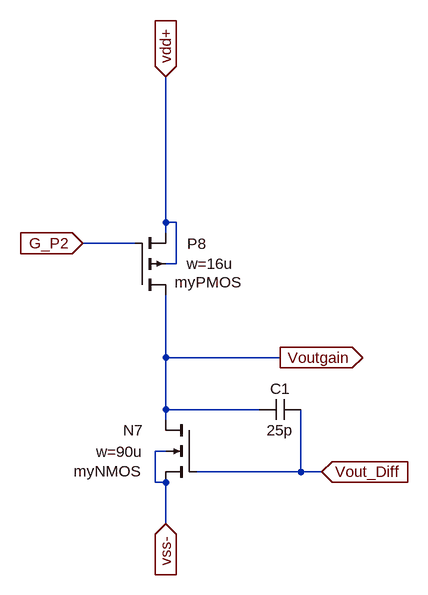
[diagram p0: schematic Gain_Amplifier.asc]
Gain_Amplifier.asc, the LTspice schematic file:
Version 4
SHEET 1 880 680
WIRE 160 -144 160 -368
WIRE 176 -144 160 -144
WIRE 160 -128 160 -144
WIRE 112 -112 32 -112
WIRE 176 -80 176 -144
WIRE 176 -80 160 -80
WIRE 160 64 160 -32
WIRE 336 64 160 64
WIRE 160 144 160 64
WIRE 304 144 160 144
WIRE 160 160 160 144
WIRE 160 208 144 208
WIRE 368 240 368 144
WIRE 368 240 208 240
WIRE 400 240 368 240
WIRE 144 256 144 208
WIRE 160 256 144 256
WIRE 160 320 160 256
FLAG 400 240 Vout_Diff
IOPIN 400 240 In
FLAG 160 -368 vdd+
IOPIN 160 -368 In
FLAG 336 64 Voutgain
IOPIN 336 64 Out
FLAG 160 320 vss-
IOPIN 160 320 In
FLAG 32 -112 G_P2
IOPIN 32 -112 In
SYMBOL pmos4 112 -32 M180
WINDOW 3 62 20 Left 2
WINDOW 0 81 79 Left 2
WINDOW 123 80 48 Left 2
SYMATTR Value myPMOS
SYMATTR InstName P8
SYMATTR Value2 w=16u
SYMBOL nmos4 208 160 M0
WINDOW 3 85 79 Left 2
WINDOW 0 83 16 Left 2
WINDOW 123 83 49 Left 2
SYMATTR Value myNMOS
SYMATTR InstName N7
SYMATTR Value2 w=90u
SYMBOL cap 368 128 R90
WINDOW 0 0 32 VBottom 2
WINDOW 3 32 32 VTop 2
SYMATTR InstName C1
SYMATTR Value 25p

The netlist it stands for:
* Gain_Amplifier.asc
M§P8 Voutgain G_P2 vdd+ vdd+ myPMOS w=16u
M§N7 Voutgain Vout_Diff vss- vss- myNMOS w=90u
C1 Vout_Diff Voutgain 25p
.model NMOS NMOS
.model PMOS PMOS
.lib standard.mos
.backanno
.end